# Altium schematic sheet 01 - POWER SUPPLY.SchDoc
size A3; SheetNumber: 1; SheetTotal: 7
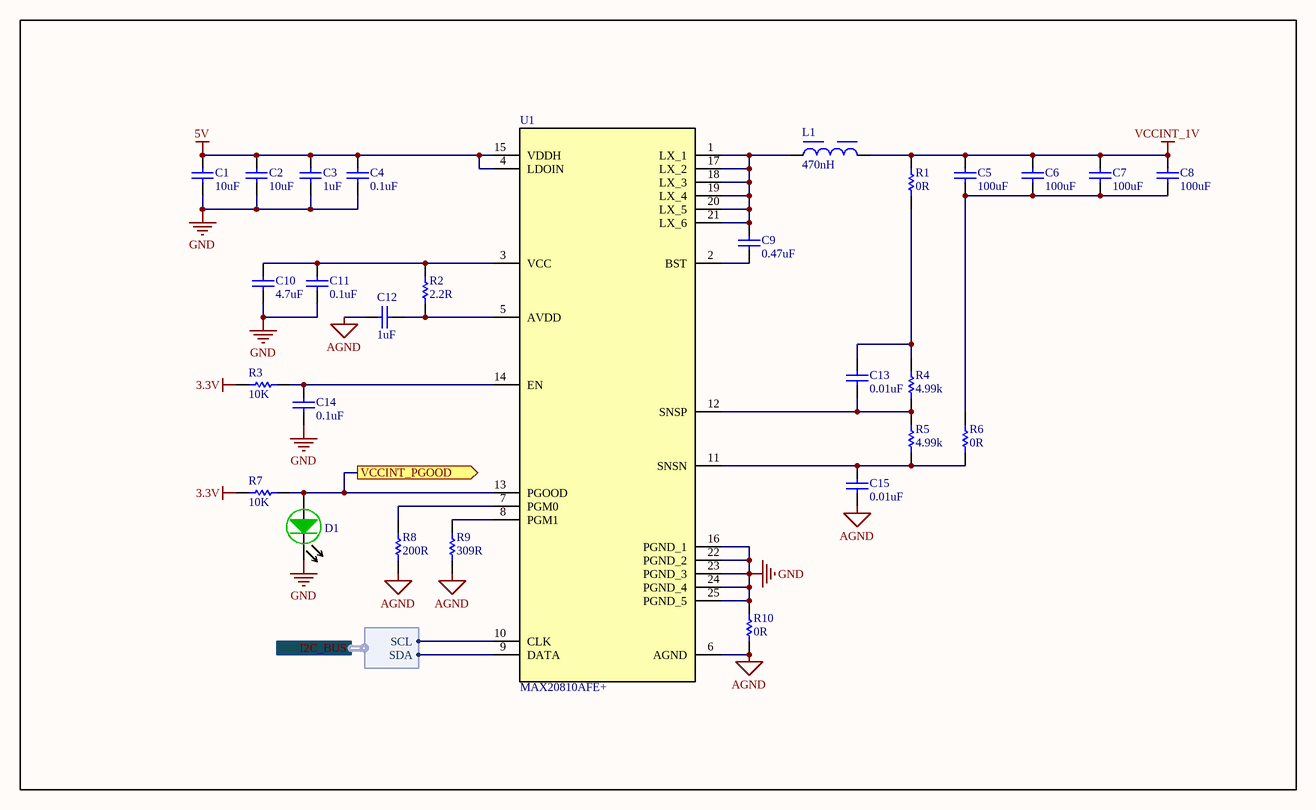
[diagram p0: 01 - POWER SUPPLY.SchDoc]

## Parts
C1  value 10uF  [0603-C-R]  (hidden comment: CAP SMD 0603 10uF 10V ±10%)
C2  value 10uF  [0603-C-R]  (hidden comment: CAP SMD 0603 10uF 10V ±10%)
C3  value 1uF  [0402-C-R]  (hidden comment: GRM155R61E105KA12D)
C4  CAPACITANCE: 0.1uF  [0402-C-R]  (hidden comment: GRM155R71C104KA88J)
C5  value 100uF  [1210-C-R]  (hidden comment: GRT32EC70J107ME13L)
C6  value 100uF  [1210-C-R]  (hidden comment: GRT32EC70J107ME13L)
C7  value 100uF  [1210-C-R]  (hidden comment: GRT32EC70J107ME13L)
C8  value 100uF  [1210-C-R]  (hidden comment: GRT32EC70J107ME13L)
C9  CAPACITANCE: 0.47uF  [0402-C-R]  (hidden comment: CGA2B1X7S1C474K050BC)
C10  value 4.7uF  [0402-C-R]  (hidden comment: GRM155D81C475ME15J)
C11  CAPACITANCE: 0.1uF  [0402-C-R]  (hidden comment: GRM155R71C104KA88J)
C12  value 1uF  [0402-C-R]  (hidden comment: JMK105BJ105KV-F)
C13  value 0.01uF  [0402-C-R]  (hidden comment: GRM155R71C103KA01D)
C14  CAPACITANCE: 0.1uF  [0402-C-R]  (hidden comment: GRM155R71C104KA88J)
C15  value 0.01uF  [0402-C-R]  (hidden comment: GRM155R71C103KA01D)
D1  LNJ347W83RA  [LED_0402]  (value not drawn)
L1  value 470nH  [WE-HCI_1365]  (hidden comment: 744355147)
R1  value 0R  [0402-R-R]  (hidden comment: RMCF0402ZT0R00)
R2  value 2.2R  [0402-R-R]  (hidden comment: RC0402FR-072R2L)
R3  value 10K  [0402-R-R]  (hidden comment: RC0402FR-0710KL)
R4  Resistence: 4.99k  [0402-R-R]  (hidden comment: RMCF0402FT4K99)
R5  Resistence: 4.99k  [0402-R-R]  (hidden comment: RMCF0402FT4K99)
R6  value 0R  [0402-R-R]  (hidden comment: RMCF0402ZT0R00)
R7  value 10K  [0402-R-R]  (hidden comment: RC0402FR-0710KL)
R8  value 200R  [0402-R-R]  (hidden comment: CRCW0402200RFKED)
R9  value 309R  [0402-R-R]  (hidden comment: RC0402FR-072R2L)
R10  value 0R  [0402-R-R]  (hidden comment: RMCF0402ZT0R00)
U1  MAX20810AFE+  [MAX20810AFE]

## Ports
I2C_BUS (harness I2C), VCCINT_PGOOD (out)

## Harnesses
I2C: SCL, SDA

## Nets
3.3V: R3.2 R7.1
5V: C1.2 C2.2 C3.2 C4.2 U1.4(LDOIN) U1.15(VDDH)
AGND: C12.2 C15.1 R8.1 R9.1 R10.1 U1.6(AGND)
GND: C1.1 C2.1 C3.1 C4.1 C10.1 C11.1 C14.1 D1.1(K) R10.2 U1.16(PGND_1) U1.22(PGND_2) U1.23(PGND_3) U1.24(PGND_4) U1.25(PGND_5)
VCCINT_1V: C5.2 C6.2 C7.2 C8.2 L1.2 R1.1
VCCINT_PGOOD: D1.2(A) R7.2 U1.13(PGOOD) ; port VCCINT_PGOOD
NetC5_1: C5.1 C6.1 C7.1 C8.1 R6.1
NetC9_1: C9.1 U1.2(BST)
NetC9_2: C9.2 L1.1 U1.1(LX_1) U1.17(LX_2) U1.18(LX_3) U1.19(LX_4) U1.20(LX_5) U1.21(LX_6)
NetC10_2: C10.2 C11.2 R2.2 U1.3(VCC)
NetC12_1: C12.1 R2.1 U1.5(AVDD)
NetC13_1: C13.1 R4.1 R5.2 U1.12(SNSP)
NetC13_2: C13.2 R1.2 R4.2
NetC14_2: C14.2 R3.1 U1.14(EN)
NetC15_2: C15.2 R5.1 R6.2 U1.11(SNSN)
NetR8_2: R8.2 U1.7(PGM0)
NetR9_2: R9.2 U1.8(PGM1)
NetU1_9: U1.9(DATA) ; port I2C_BUS.SDA
NetU1_10: U1.10(CLK) ; port I2C_BUS.SCL

## Notes on the sheet
- Nome da Sheet:
- Data:
- Projetista:
- PCB Design:
- LESC - Laboratório de Engenharia e Sistemas de Computação
- Campus do Pici - Bloco 723, S/N - Pici, Fortaleza - CE, 60455-970
- Julio Vitorino
- Revision:
- Size:

## Library data of the parts
C1 C2 = CAP SMD 0603 10uF 10V ±10%: CAP SMD 0603 MLCC GERAL 10uF 10V ±10% X7R PN: GRM188Z71A106KA73D; SIZE: 0603; PN: GRM188Z71A106KA73D; VOLTAGE: 10V; TOLERANCE: 10%
C3 = CAP SMD 0402 1uF 25V ±10%: CAP SMD 0402 MLCC GERAL 1uF 25V ±10% 0402 X5R PN:GRM155R61E105KA12D MURATA; SIZE: 0402; VOLTAGE: 25V; TOLERANCE: 10%; PN: GRM155R61E105KA12D
C4 C11 C14 = CAP CER 0.1UF 16V X7R 0402: 0.1 µF ±10% 16V Ceramic Capacitor X7R 0402 (1005 Metric) / PN: GRM155R71C104KA88J; Mfr_Name: Murata; PN: GRM155R71C104KA88J
C5-C8 = CAP SMD 1210 100uF 6.3V X7S ±20%: CAP SMD 1210 MLCC GERAL 100uF 6.3V ±20% X7S PN: GRM31CD80J107MEA8K; SIZE: 1210; VOLTAGE: 6.3V; TOLERANCE: 20%; PN: GRT32EC70J107ME13L
C9 = CAP CER 0.47UF 16V X7S 0402: 0.1 µF ±10% 16V Ceramic Capacitor X7R 0402 (1005 Metric) / PN: CGA2B1X7S1C474K050BC; Mfr_Name: Murata; PN: CGA2B1X7S1C474K050BC
C10 = CAP CER 4.7UF 25V X5R 0402: CAP SMD 0402 MLCC GERAL 4.7uF 25V ±20% 0402 X5s PN: GRM155D81C475ME15J MURATA; SIZE: 0402; VOLTAGE: 25V; TOLERANCE: 20%; PN: GRM155D81C475ME15J
C12 = CAP CER 1UF 6.3V X5R 0402: 1 µF ±10% 6.3V Ceramic Capacitor X5R 0402 (1005 Metric); SIZE: 0402; VOLTAGE: 6.3V; TOLERANCE: 10%; PN: JMK105BJ105KV-F
C13 C15 = CAP CER 10000PF 16V X7R 0402: 10000 pF ±10% 16V Ceramic Capacitor X7R 0402 (1005 Metric); SIZE: 0402; VOLTAGE: 16V; TOLERANCE: 10%; PN: GRM155R71C103KA01D
D1 = LED GREEN 0402 SMD: Green 572nm LED Indication - Discrete 1.95V 0402 (1005 Metric); ID: ?; PN: LNJ347W83RA
L1 = IND 470NH 30A 0.67 MOHM: FIXED IND 470NH 30A 0.67 MOHM PN: 744355147; MF: {'manufacturer': u'W\xfcrth Elektronik'}; Package: None; Price: None; PN: 744355147; Availability: Unavailable
R1 R6 R10 = RES SMD 0402 0R 0.063W ±1%: RES SMD GERAL FILM 0R 0.063W ±1% 0402 7" TAPE PN: RMCF0402ZT0R00 STACKPOLE; PACK: 0402; TOLERANCE: 1%; POWER: 0.063W; PN: RMCF0402ZT0R00
R2 = RES SMD 0402 2.2R 0.063W ±1%: RES SMD GERAL FILM 2.2R 0.063W ±1% 0402 7" TAPE PN: RC0402FR-072R2L; PACK: 0402; POWER: 0.063W; TOLERANCE: 1%; PN: RC0402FR-072R2L
R3 R7 = RES 10K OHM 1% 1/16W 0402: 10 kOhms ±1% 0,063W, 1/16W Resistor de chip 0402 (métrico 1005) Resistente à umidade Filme grosso; PACK: 0402; POWER: 0.063W; TOLERANCE: 1%; PN: RC0402FR-0710KL
R4 R5 = RES SMD 4K99 OHM 1% 1/16W 0402: 4.99 kOhms ±0.1% 0.063W, 1/16W Chip Resistor 0402 (1005 Metric) Automotive AEC-Q200 Thin Film; Mfr_Name: Yageo; Tolerance: 1%; PN: RMCF0402FT4K99
R8 = RES SMD 0402 200R 0.063W ±1%: RES SMD GERAL FILM 200R 0.063W ±1% 0402 7" TAPE PN: CRCW0402200RFKED; PACK: 0402; POWER: 0.063W; TOLERANCE: 1%; PN: CRCW0402200RFKED
R9 = RES SMD 0402 309R 0.063W ±1%: RES SMD GERAL FILM 309R 0.063W ±1% 0402 7" TAPE PN: RC0402FR-072R2L; PACK: 0402; PN: RC0402FR-07309RL; POWER: 0.063W; TOLERANCE: 1%
U1 = IC REG BUCK ADJ 10A 16FC2QFN: IC REG BUCK ADJ 10A 16FC2QFN PN:MAX20810AFE+; Manufacturer_Name: Analog Devices; Datasheet Link: https://www.digikey.com/en/products/detail/analog-devices-inc-maxim-integrated/MAX20810AFE/22463000?msockid=2ab7f999c9c96f4c2a13ec8dc8dd6eef; Height: 0.75mm; Mouser Part Number: 700-MAX20810AFE+; Mouser Price/Stock: https://www.mouser.co.uk/ProductDetail/Analog-Devices-Maxim-Integrated/MAX20810AFE%2b?qs=ST9lo4GX8V1Nvp4d0%2FgnXQ%3D%3D; PN: MAX20810AFE+; Description: 10A